# EAGLE design ATmega8U2breakout (EAGLE 5.11)
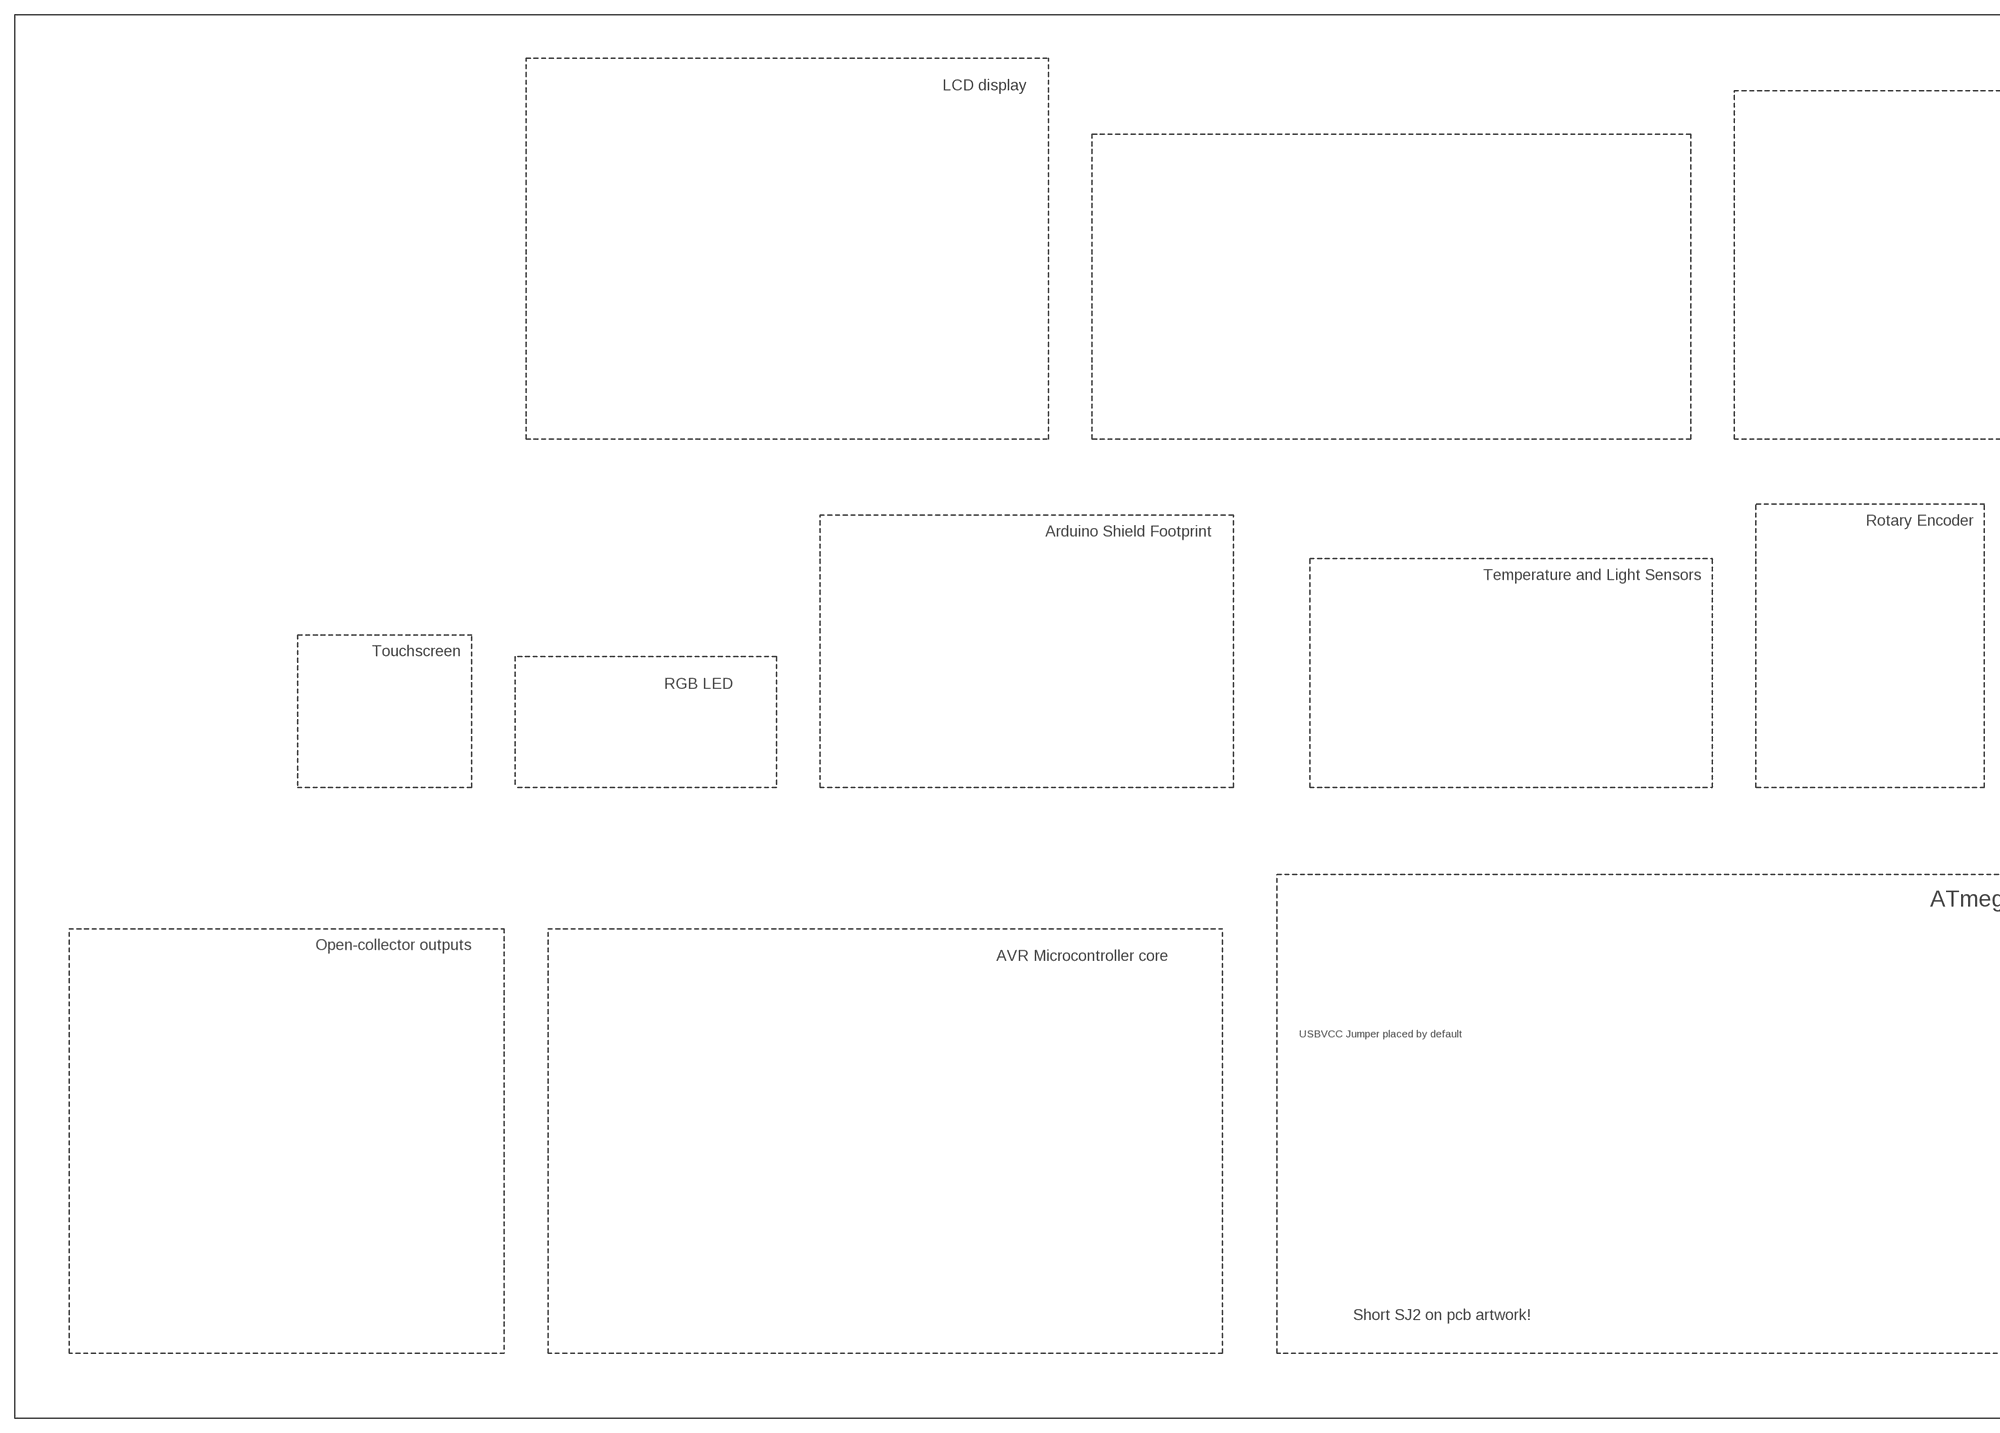
[diagram p0: schematic, sheet 1, part 1 of 2]
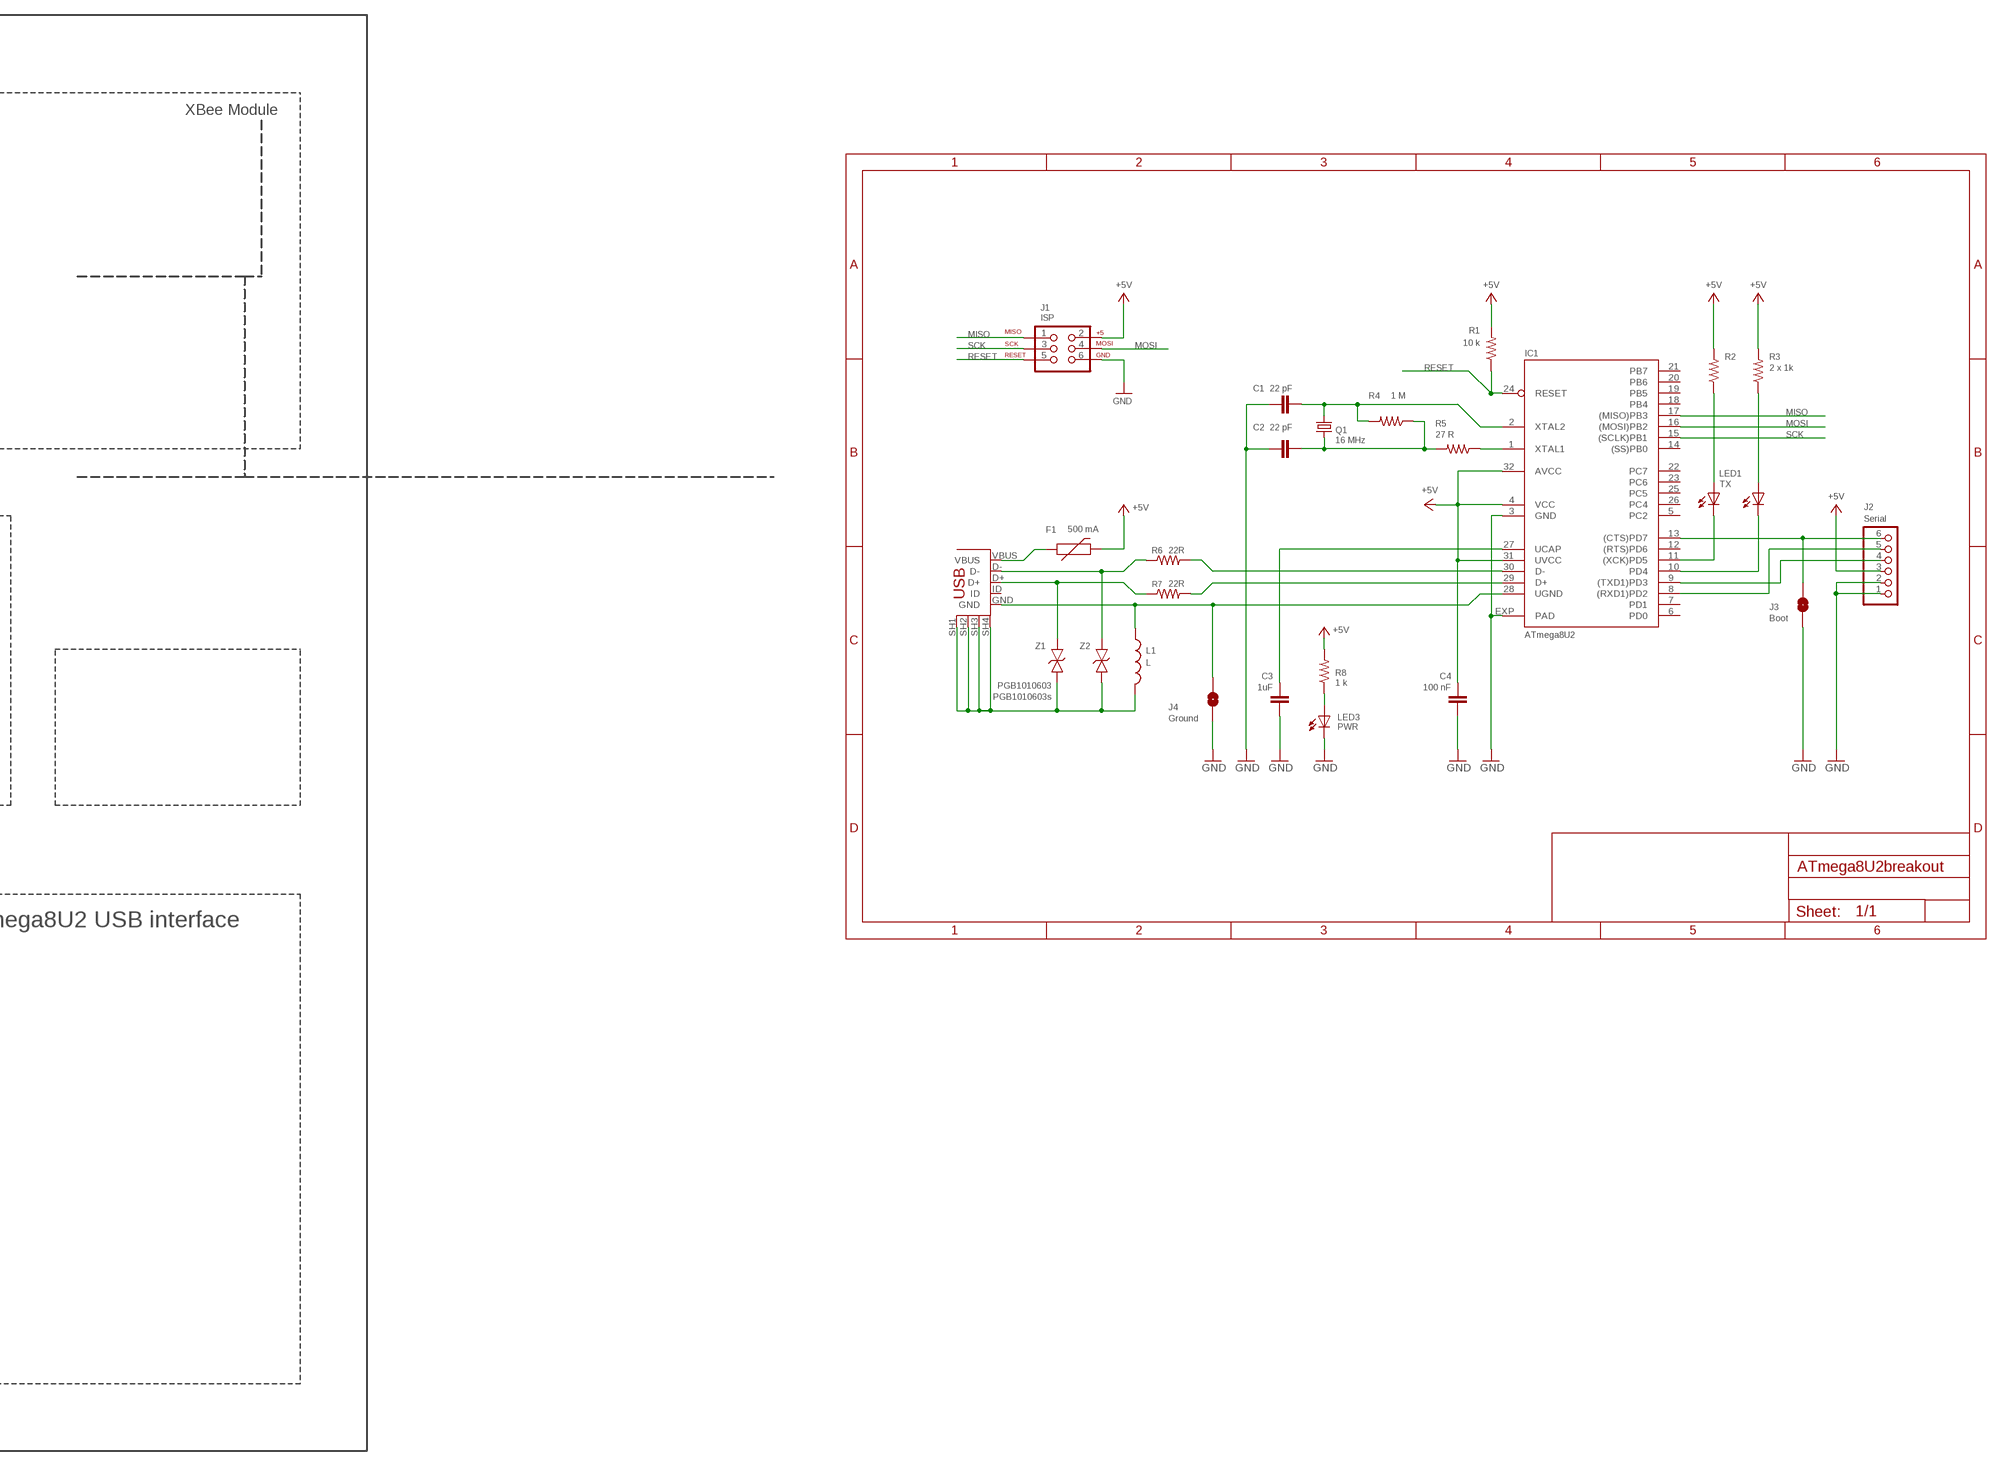
[diagram p1: schematic, sheet 1, part 2 of 2]

## Parts
C1  22 pF  C-EUC0805K  [C0805K]
C2  22 pF  C-EUC0805K  [C0805K]
C3  1uF  C-EUC0805K  [C0805K]
C4  100 nF  C-EUC0805K  [C0805K]
F1  500 mA  PTC1812  [1812]
IC1  ATmega8U2  ATMEL_ATMEGA8U2-MUQFN  [ATMEL_QFN32]
J1  ISP  [ISP]
J2  Serial  PINHD-1X6  [1X06]
J3  Boot  SJ  [SJ]
J4  Ground  SJ  [SJ]
L1  L  INDUCTOR0805-LARGE  [0805-LARGE]
LED1  TX  LEDCHIPLED_0805  [CHIPLED_0805]
LED2  RX  LEDCHIPLED_0805  [CHIPLED_0805]
LED3  PWR  LEDCHIPLED_0805  [CHIPLED_0805]
P1  USB  USB-FT  [USB-MINIB-FT]
Q1  16 MHz  CRYSTALHC49U-V  [HC49U-V]
R1  10 k  R-US_M0805  [M0805]
R2  2 x 1k  R-US_M0805  [M0805]
R3  1 k  R-US_M0805  [M0805]
R4  1 M  R-US_M0805  [M0805]
R5  27 R  R-US_M0805  [M0805]
R6  22R  R-US_M0805  [M0805]
R7  22R  R-US_M0805  [M0805]
R8  1 k  R-US_M0805  [M0805]
Z1  PGB1010603s  TVS_0603  [FREETRONICS_0603]
Z2  PGB1010603  TVS_0603  [FREETRONICS_0603]

## Nets
+5V: C4.2 F1.2 IC1.4(VCC) IC1.31(UVCC) IC1.32(AVCC) J1.2 J2.3 R1.2 R2.2 R3.2 R8.2
D+: P1.D+ R7.1 Z1.1
D-: P1.D- R6.1 Z2.1
DTR(CTS): IC1.13((CTS)PD7) J2.6 J3.2
GND: C1.1 C2.1 C3.1 C4.1 IC1.3(GND) IC1.EXP(PAD) J1.6 J2.1 J2.2 J3.1 J4.1 LED3.C
MISO: IC1.17((MISO)PB3) J1.1
MOSI: IC1.16((MOSI)PB2) J1.4
N$1: C2.2 Q1.1 R4.1 R5.2
N$2: LED3.A R8.1
N$5: IC1.28(UGND) J4.2 L1.1 P1.GND
N$6: IC1.1(XTAL1) R5.1
N$9: L1.2 P1.SH1(SH$1) P1.SH2(SH$2) P1.SH3(SH$3) P1.SH4(SH$4) Z1.2 Z2.2
N$35: LED2.A R3.1
N$36: LED1.A R2.1
RD+: IC1.29(D+) R7.2
RD-: IC1.30(D-) R6.2
RESET: IC1.24(RESET) J1.5 R1.1
RXD: IC1.8((RXD1)PD2) J2.5
RXLED: IC1.10(PD4) LED2.C
SCK: IC1.15((SCLK)PB1) J1.3
TXD: IC1.9((TXD1)PD3) J2.4
TXLED: IC1.11((XCK)PD5) LED1.C
VUCAP: C3.2 IC1.27(UCAP)
XT2: C1.2 IC1.2(XTAL2) Q1.2 R4.2
XUSB [usbvcc]: F1.1 P1.VBUS
Unconnected: IC1.5(PC2) IC1.6(PD0) IC1.7(PD1) IC1.12((RTS)PD6) IC1.14((SS)PB0) IC1.18(PB4) IC1.19(PB5) IC1.20(PB6) IC1.21(PB7) IC1.22(PC7) IC1.23(PC6) IC1.25(PC5) IC1.26(PC4) P1.ID

## Notes on the sheet
- LCD display
- XBee Module
- Rotary Encoder
- Arduino Shield Footprint
- Temperature and Light Sensors
- Touchscreen
- RGB LED
- ATmega8U2 USB interface
- Open-collector outputs
- AVR Microcontroller core
- USBVCC Jumper placed by default
- Short SJ2 on pcb artwork!

## Library data of the parts
C1-C4 = rcl:C-EU: CAPACITOR, European symbol
F1 = EtherMega2:PTC1812
IC1 = freetronics-jon:ATMEL_ATMEGA8U2-MU
J1 = Luke:ISP
J2 = pinhead:PINHD-1X6: PIN HEADER
J3 J4 = jumper:SJ: SMD solder JUMPER
L1 = freetronics-master-v1:INDUCTOR: Inductors Basic Inductor/Choke - 0603 and 1206. Footprints are not proven and vary greatly between part numbers.
LED1-LED3 = led:LED: LED OSRAM: - CHIPLED LG R971, LG N971, LY N971, LG Q971, LY Q971, LO R971, LY R971 LH N974, LH R974 LS Q976, LO Q976, LY Q976 LO Q996 - Hyper CHIPLED LW Q18S LB Q993, LB Q99A, LB R99A - SideLED LS A670, LO A670, LY A670, LG A670, LP A670 LB A673, LV A673, LT A673, LW A673 LH A674 LY A675 LS A676, LA A676, LO A676, LY A676, LW A676 LS A679, LY A679, LG A679 - Hyper Micro SIDELED® LS Y876, LA Y876, LO Y876, LY Y876 LT Y87S - SmartLED LW L88C, LW L88S LB L89C, LB L89S, LG L890 LS L89K, LO L89K, LY L89K LS L896, LA L896, LO L896, LY L896 - TOPLED LS T670, LO T670, LY T670, LG T670, LP T670 LSG T670, LSP T670, LSY T670, LOP T670, LYG T670 LG T671, LOG T671, LSG T671 LB T673, LV T673, LT T673, LW T673 LH T674 LS T676, LA T676, LO T676, LY T676, LB T676, LH T676, LSB T676, LW T676 LB T67C, LV T67C, LT T67C, LS T67K, LO T67K, LY T67K, LW E67C LS E67B, LA E67B, LO E67B, LY E67B, LB E67C, LV E67C, LT E67C LW T67C LS T679, LY T679, LG T679 LS T770, LO T770, LY T770, LG T770, LP T770 LB T773, LV T773, LT T773, LW T773 LH T774 LS E675, LA E675, LY E675, LS T675 LS T776, LA T776, LO T776, LY T776, LB T776 LHGB T686 LT T68C, LB T68C - Hyper Mini TOPLED® LB M676 - Mini TOPLED Santana® LG M470 LS M47K, LO M47K, LY M47K Source: http://www.osram.convergy.de LUXEON: - LUMILED® LXK2-PW12-R00, LXK2-PW12-S00, LXK2-PW14-U00, LXK2-PW14-V00 LXK2-PM12-R00, LXK2-PM12-S00, LXK2-PM14-U00 LXK2-PE12-Q00, LXK2-PE12-R00, LXK2-PE12-S00, LXK2-PE14-T00, LXK2-PE14-U00 LXK2-PB12-K00, LXK2-PB12-L00, LXK2-PB12-M00, LXK2-PB14-N00, LXK2-PB14-P00, LXK2-PB14-Q00 LXK2-PR12-L00, LXK2-PR12-M00, LXK2-PR14-Q00, LXK2-PR14-R00 LXK2-PD12-Q00, LXK2-PD12-R00, LXK2-PD12-S00 LXK2-PH12-R00, LXK2-PH12-S00 LXK2-PL12-P00, LXK2-PL12-Q00, LXK2-PL12-R00 Source: www.luxeon.com KINGBRIGHT: KA-3528ASYC Source: www.kingbright.com
P1 = freetronics-master-v1:USB-FT
Q1 = crystal:CRYSTAL: CRYSTAL; OC_FARNELL: 1666969; OC_NEWARK: unknown
R1-R8 = rcl:R-US_: RESISTOR, American symbol
Z1 Z2 = EtherMega2:TVS_0603

## Net classes
1 power: width 0.61 mm, clearance 0.254 mm
2 gnd: width 0.305 mm, drill 0.559 mm, clearance 0.254 mm
3 usbvcc: width 0.356 mm, clearance 0.254 mm
4 aref: width 0.406 mm, drill 0.61 mm, clearance 0.254 mm

## Board
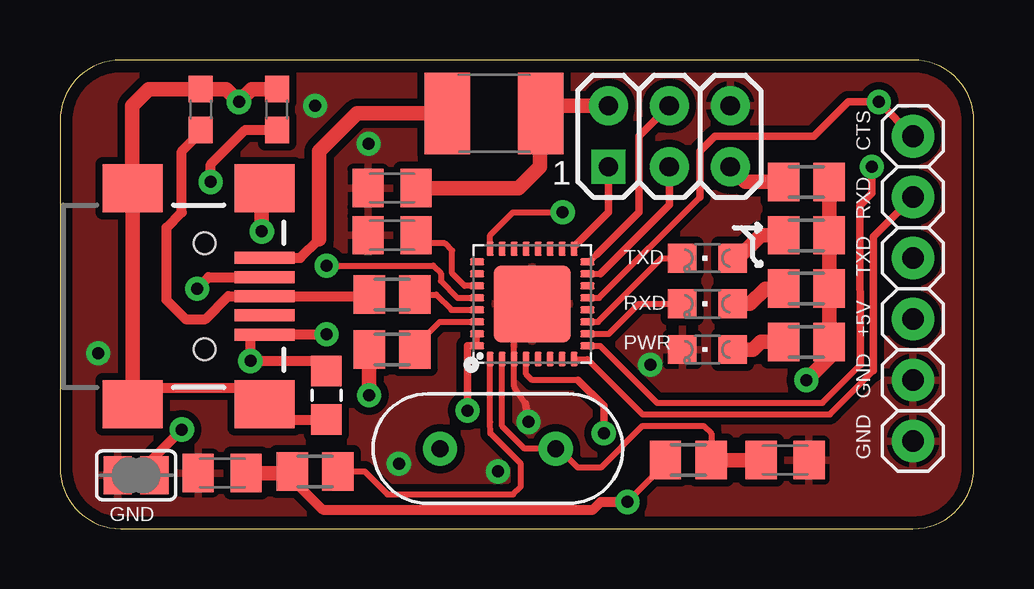
[diagram p2: board, top side]
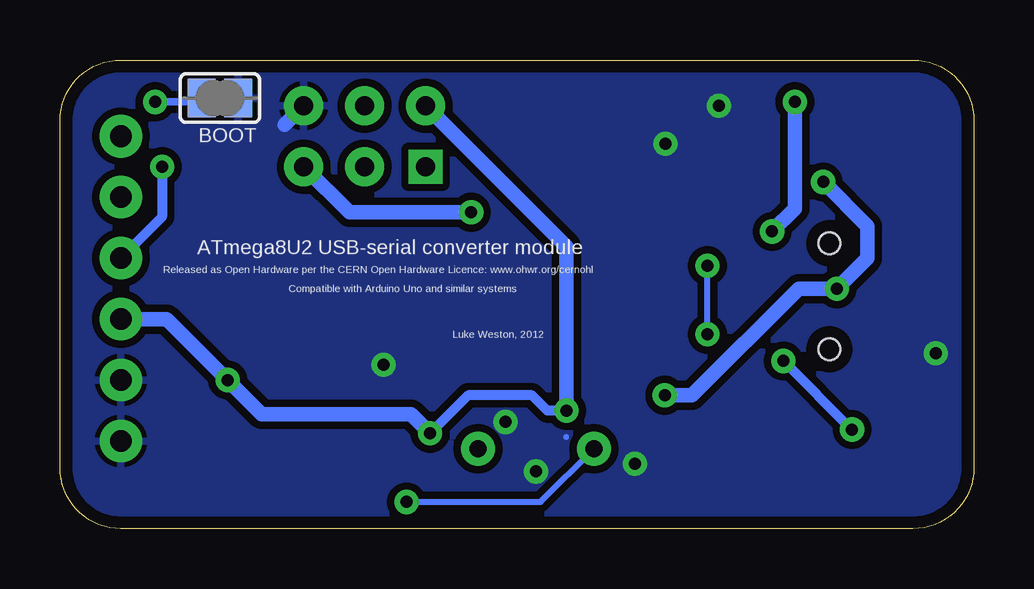
[diagram p3: board, bottom side, seen from below]

Size 38.1 x 19.53 mm. Coordinates in mm from the lower left corner, seen from the top.
Outline: 0,2.54 arc90 2.54,0 35.56,0 arc90 38.1,2.54 38.1,16.99 arc90 35.56,19.53 2.54,19.53 arc90 0,16.99 0,2.54
Copper layers (1*16): Top 0.035mm / dielectric 1.5mm / Bottom 0.035mm
Design rules "PCBCart-Standard": minimum track width 8mil, minimum drill 0.4mm, track to track 8mil, track to pad 8mil, pad to pad 8mil, via to via 8mil, smd to smd 8mil, copper to edge 20mil, drill to drill 8mil, minimum pad ring 8mil, minimum via ring 10mil, stop-mask expansion 3mil, vias tented up to drill 0mil, thermal gap 8mil

### Footprints (pad centres in the part's own frame; a part is rotated, then mirrored left to right if it is on the bottom)
C0805K = smd 1.3 x 1.6: 1 -1,0; 2 1,0
1812 = smd 1.9 x 3.4: 1 -1.95,0; 2 1.95,0
ATMEL_QFN32 = smd 0.6 x 0.3: 1 -2.3,1.75; 2 -2.3,1.25; 3 -2.3,0.75; 4 -2.3,0.25; 5 -2.3,-0.25; 6 -2.3,-0.75; 7 -2.3,-1.25; 8 -2.3,-1.75; 17 2.3,-1.75; 18 2.3,-1.25; 19 2.3,-0.75; 20 2.3,-0.25; 21 2.3,0.25; 22 2.3,0.75; 23 2.3,1.25; 24 2.3,1.75 | smd 0.3 x 0.6: 9 -1.75,-2.3; 10 -1.25,-2.3; 11 -0.75,-2.3; 12 -0.25,-2.3; 13 0.25,-2.3; 14 0.75,-2.3; 15 1.25,-2.3; 16 1.75,-2.3; 25 1.75,2.3; 26 1.25,2.3; 27 0.75,2.3; 28 0.25,2.3; 29 -0.25,2.3; 30 -0.75,2.3; 31 -1.25,2.3; 32 -1.75,2.3 | smd 3.2 x 3.2: EXP 0,0
ISP = drill 0.8 pad 1.422 square: 1 -2.54,-1.27 | drill 0.8 pad 1.626 round: 2 -2.54,1.27; 3 0,-1.27; 4 0,1.27; 5 2.54,-1.27; 6 2.54,1.27
1X06 = drill 0.9 pad 1.778 round: 1 -6.35,0; 2 -3.81,0; 3 -1.27,0; 4 1.27,0; 5 3.81,0; 6 6.35,0
SJ = smd 1.168 x 1.6: 1 -0.762,0; 2 0.762,0
0805-LARGE = smd 1.27 x 1.27: 1 -1.016,0; 2 1.016,0
CHIPLED_0805 = smd 1.2 x 1.2: A 0,-1.05; C 0,1.05
USB-MINIB-FT = smd 2.5 x 0.5: D+ 2.5,0; D- 2.5,0.8; GND 2.5,-1.6; ID 2.5,-0.8; VBUS 2.5,1.6 | smd 2.5 x 2: SH1 -3,-4.5; SH2 -3,4.5; SH3 2.5,4.5; SH4 2.5,-4.5 | hole 0.9: 0,2.2; 0,-2.2
HC49U-V = drill 0.7 pad 1.422 round: 1 -2.413,0; 2 2.413,0
M0805 = smd 1.3 x 1.6: 1 -0.95,0; 2 0.95,0
FREETRONICS_0603 = smd 1.1 x 1: 1 -0.85,0; 2 0.85,0

### Placement (x,y rotation side)
C1  30.23,2.86 180 top
C2  6.76,2.32 0 top
C3  13.84,12.22 0 top
C4  13.84,14.19 0 top
F1  18.1,17.3 0 top
IC1  19.68,9.37 90 top
J1  25.4,16.35 0 top
J2  35.56,10 90 top
J3  31.43,17.94 180 bottom
J4  3.18,2.22 0 top
L1  11.11,5.56 270 top
LED1  26.99,11.27 90 top
LED2  26.99,9.37 90 top
LED3  26.99,7.46 90 top
P1  6.03,9.68 0 top
Q1  18.26,3.33 0 top
R1  31.11,14.45 0 top
R2  31.11,12.22 0 top
R3  31.11,10 0 top
R4  26.19,2.86 0 top
R5  10.64,2.38 180 top
R6  13.84,7.46 0 top
R7  13.84,9.75 0 top
R8  31.11,7.78 0 top
Z1  5.87,17.46 90 top
Z2  9.05,17.46 90 top

### Tracks (layer width: path | path; a pad name or v marks a point on that pad's centre or on a via)
+5V  (via drill 0.5)
  Top 0.203: 17.3,7.62 IC1.32
  Top 0.254: IC1.4 19.43,6.44 19.68,6.19 21.59,6.19 | IC1.32 IC1.31
  Top 0.305: v22.67,3.97 22.67,5.11 21.59,6.19 | v16.99,4.92 16.99,7.62 17.3,7.62
  Top 0.61: J1.2 20.36,17.62 F1.2 20,17.26 20,15.08 19.11,14.19 C4.2 | v31.11,6.19 32.06,7.14 R8.2 R3.2 R2.2 R1.2
  Bottom 0.406: 18.41,5.56 21.08,5.56 v22.67,3.97 | 18.41,5.56 | 18.41,5.56 17.78,4.92 v16.99,4.92
  Bottom 0.61: v16.99,4.92 16.99,11.75 J1.2 | J2.3 33.66,8.73 v31.11,6.19 29.69,4.76 23.46,4.76 v22.67,3.97
D+
  Top 0.406: R7.1 12.83,9.68 P1.D+ 7.02,9.68 6.06,8.73 5.24,8.73 4.45,9.53 4.45,12.54 5.08,13.18 5.08,15.72 5.87,16.51 Z1.1
D-  (via drill 0.5)
  Top 0.406: P1.D- 6.2,10.48 v5.71,10 | Z2.1 7.72,16.61 6.29,15.18 v6.29,14.45
  Top 0.61: R6.1 v12.89,5.56
  Bottom 0.61: v12.89,5.56 11.75,5.56 7.3,10 v5.71,10 4.45,11.27 4.45,12.61 v6.29,14.45
DTR(CTS)  (via drill 0.5)
  Top 0.254: 26.67,13.81 22.48,9.62 IC1.13
  Top 0.305: 26.67,13.81 26.67,15.72 27.3,16.35 31.43,16.35 32.86,17.78 v34.13,17.78 J2.6
  Bottom 0.305: v34.13,17.78 32.38,17.78 J3.2
GND  (via drill 0.5)
  Top 0.254: 18.89,7.94 18.93,7.89 | 18.89,8.26 18.93,8.21 IC1.3 18.93,5.92 19.41,5.2
  Top 0.305: 18.89,8.1 18.89,7.94 | 18.89,8.1 18.89,8.26 18.89,8.57 19.13,8.81 | 19.13,8.81 IC1.EXP | 18.41,9.68 18.35,9.62 18.35,9.59 19.13,8.81 | 18.89,8.1 18.93,8.05 | v19.53,4.45 19.41,5.2
  Bottom 0.254: J1.6 28.1,17.46 | 16.99,3.81
  Bottom 0.61: J1.6 28.73,16.83
  other vias: 12.86,16.03 24.61,6.83 10.64,17.62 1.59,7.3 14.13,2.7 18.26,2.38
  pour Top (isolate 0.305): -1.27,20.64 39.37,20.64 39.37,-0.16 -1.27,-0.16
  pour Bottom (isolate 0.305): -1.27,20.64 39.37,20.64 39.37,-0.16 -1.27,-0.16
MISO
  Top 0.254: IC1.17 21.43,11.75
  Top 0.305: 21.43,11.75 21.75,12.07 22.86,13.18 J1.1
MOSI
  Top 0.254: 22.38,11.43 22.07,11.12 IC1.16
  Top 0.305: 24.13,13.18 24.13,16.35 J1.4 | 24.13,13.18 | 22.38,11.43 24.13,13.18
N$1  (via drill 0.5)
  Top 0.254: R5.2 9.69,2.54 | R4.1 25.24,2.7 v23.65,1.11
  Top 0.406: 9.69,2.54 9.69,2.06 10.95,0.79 22.23,0.79 22.54,1.11 v23.65,1.11
  Top 0.61: C2.2 9.62,2.32 R5.2
  Bottom 0.254: v23.65,1.11 18.07,1.11 Q1.1
N$2
  Top 0.61: LED3.A 28.89,7.46 29.21,7.78 R8.1
N$3
  Top 0.203: 3.65,2.22 2.7,2.22
N$5  (via drill 0.5)
  Top 0.254: IC1.28 16.58,9.62 15.88,10.32 15.88,10.64 15.56,10.95 v11.11,10.95
  Top 0.406: v11.11,8.1 8.54,8.1 P1.GND 7.94,8.08 v7.94,6.99 11.11,6.99 L1.1 10.86,6.83 | J4.2 4.1,2.67 | J4.2 4.29,2.57 | v5.08,4.13 | v5.08,4.13 3.81,2.86 3.81,2.51 J4.2
  Bottom 0.254: v11.11,8.1 v11.11,10.95
  Bottom 0.406: v5.08,4.13 v7.94,6.99
N$6
  Top 0.254: IC1.1 17.93,4.44 17.94,3.97 19.21,2.7 19.21,1.75 18.89,1.43 13.65,1.43 12.7,2.38 R5.1 11.75,2.38 12.06,2.06
N$9  (via drill 0.5)
  Top 0.406: L1.2 9.18,4.54 P1.SH4 8.31,5.18 7.62,5.87 3.19,5.87 3.03,5.72
  Top 0.61: P1.SH1 3.03,5.72 P1.SH2 3.02,14.2 3.02,17.62 3.71,18.31 Z1.2 6.93,18.31 v7.46,17.78 7.99,18.31 Z2.2 | v8.41,12.38 8.41,14.07 P1.SH3
  Bottom 0.61: v7.46,17.78 7.46,13.34 v8.41,12.38
N$35
  Top 0.61: LED2.A 28.77,9.37 29.4,10 R3.1
N$36
  Top 0.61: LED1.A 28.26,11.27 29.21,12.22 R2.1
RD+
  Top 0.254: R7.2 15.68,9.75 16.32,9.12 IC1.29
RD-
  Top 0.254: 14.79,7.59 15.82,8.62 IC1.30
  Top 0.305: 14.79,7.59 15.05,7.59 R6.2
RESET  (via drill 0.5)
  Top 0.254: v20.95,13.18 18.88,13.18 17.93,12.23 IC1.24
  Top 0.61: J1.5 28.57,14.45 R1.1
  Bottom 0.61: v20.95,13.18 26.04,13.18 J1.5
RXD
  Top 0.254: 33.91,6.57 32.1,4.76 24.29,4.76 21.98,7.07 IC1.8
  Top 0.305: 33.91,6.57 33.91,12.16 J2.5
RXLED
  Top 0.254: LED2.C 24.13,9.37 22.88,8.12 IC1.10
SCK
  Top 0.254: IC1.15 22.52,10.62
  Top 0.305: 22.52,10.62 25.4,13.49 J1.3
TXD  (via drill 0.5)
  Top 0.254: 33.37,6.83 31.78,5.24 24.89,5.24 22.52,7.62 IC1.9
  Top 0.305: 33.37,6.83 33.34,13.02 33.34,13.46 33.85,13.97 v33.85,15.08
  Bottom 0.406: v33.85,15.08 33.85,12.99 J2.4
TXLED
  Top 0.254: LED1.C 25.08,11.27 22.43,8.62 IC1.11
VUCAP
  Top 0.254: 15.11,11.89 16.05,11.89 16.35,11.59 16.35,10.64 16.87,10.12 IC1.27
  Top 0.305: 15.11,11.89 C3.2
XT2
  Top 0.254: IC1.2 18.43,4.27 19.37,3.33 Q1.2 20.8,3.33 21.59,2.54 22.54,2.54 24.29,4.29 26.83,4.29 27.15,3.97 R4.2
  Top 0.61: R4.2 C1.2 | R4.2
XUSB
  Top 0.406: P1.VBUS 10.01,11.28 10.79,12.07
  Top 0.61: F1.1 12.38,17.3 10.79,15.72 10.79,12.07

### Text on the board
tPlace: CTS | 1 | RXD | TXD | TXD | RXD | PWR | +5V | GND | GND | GND
bPlace: BOOT | ATmega8U2 USB-serial converter module | Released as Open Hardware per the CERN Open Hardware Licence: www.ohwr.org/cernohl | Compatible with Arduino Uno and similar systems | Luke Weston, 2012
214bmp: D:/SmartProjects/Snc/a4_bn_logo2.bmp